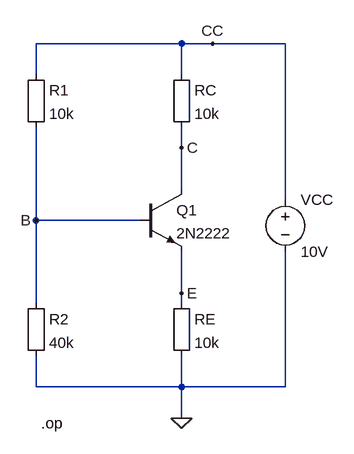
[diagram p0: schematic circuit1a.asc]
circuit1a.asc, the LTspice schematic file:
Version 4
SHEET 1 880 680
WIRE 256 -96 32 -96
WIRE 304 -96 256 -96
WIRE 416 -96 304 -96
WIRE 32 -48 32 -96
WIRE 256 -48 256 -96
WIRE 256 64 256 32
WIRE 256 128 256 64
WIRE 416 144 416 -96
WIRE 32 176 32 32
WIRE 192 176 32 176
WIRE 256 288 256 224
WIRE 32 304 32 176
WIRE 256 304 256 288
WIRE 32 432 32 384
WIRE 256 432 256 384
WIRE 256 432 32 432
WIRE 416 432 416 224
WIRE 416 432 256 432
WIRE 256 480 256 432
FLAG 256 480 0
FLAG 32 176 B
FLAG 256 288 E
FLAG 256 64 C
FLAG 304 -96 CC
SYMBOL npn 192 128 R0
SYMATTR InstName Q1
SYMATTR Value 2N2222
SYMBOL Misc\\EuropeanResistor 240 -64 R0
SYMATTR InstName RC
SYMATTR Value 10k
SYMBOL Misc\\EuropeanResistor 240 288 R0
SYMATTR InstName RE
SYMATTR Value 10k
SYMBOL Misc\\EuropeanResistor 16 288 R0
SYMATTR InstName R2
SYMATTR Value 40k
SYMBOL Misc\\EuropeanResistor 16 -64 R0
SYMATTR InstName R1
SYMATTR Value 10k
SYMBOL voltage 416 128 R0
WINDOW 123 0 0 Left 0
WINDOW 39 0 0 Left 0
SYMATTR InstName VCC
SYMATTR Value 10V
TEXT 40 488 Left 2 !.op

The netlist it stands for:
* circuit1a.asc
Q1 C B E 0 2N2222
RC CC C 10k
RE E 0 10k
R2 B 0 40k
R1 CC B 10k
VCC CC 0 10V
.model NPN NPN
.model PNP PNP
.lib standard.bjt
.op
.backanno
.end